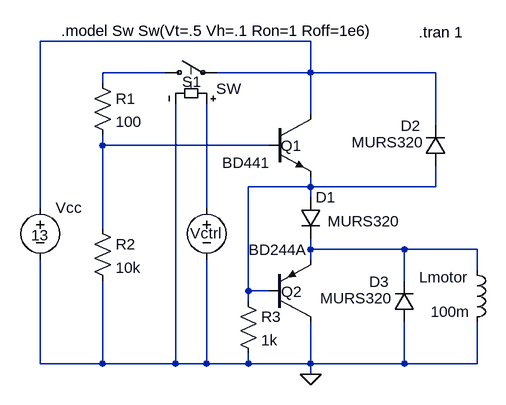
[diagram p0: schematic 2qSwMotorCc&Freno.asc]
2qSwMotorCc&Freno.asc, the LTspice schematic file:
Version 4
SHEET 1 880 680
WIRE 0 208 0 -48
WIRE 0 448 0 288
WIRE 96 16 96 0
WIRE 96 112 96 96
WIRE 96 240 96 112
WIRE 96 448 0 448
WIRE 96 448 96 320
WIRE 192 0 96 0
WIRE 208 448 96 448
WIRE 208 448 208 48
WIRE 256 208 256 48
WIRE 256 448 208 448
WIRE 256 448 256 288
WIRE 320 336 320 176
WIRE 320 352 320 336
WIRE 320 448 256 448
WIRE 320 448 320 432
WIRE 352 112 96 112
WIRE 352 336 320 336
WIRE 416 -48 0 -48
WIRE 416 0 272 0
WIRE 416 0 416 -48
WIRE 416 64 416 0
WIRE 416 176 320 176
WIRE 416 176 416 160
WIRE 416 192 416 176
WIRE 416 272 416 256
WIRE 416 288 416 272
WIRE 416 448 320 448
WIRE 416 448 416 384
WIRE 416 464 416 448
WIRE 560 272 416 272
WIRE 560 320 560 272
WIRE 560 448 416 448
WIRE 560 448 560 384
WIRE 608 0 416 0
WIRE 608 80 608 0
WIRE 608 176 416 176
WIRE 608 176 608 144
WIRE 672 272 560 272
WIRE 672 304 672 272
WIRE 672 448 560 448
WIRE 672 448 672 384
FLAG 416 464 0
SYMBOL pnp2 352 384 M180
WINDOW 0 19 47 Left 0
WINDOW 3 -31 111 Left 0
SYMATTR InstName Q2
SYMATTR Value BD244A
SYMBOL npn2 352 64 R0
WINDOW 0 18 49 Left 0
WINDOW 3 -72 75 Left 0
SYMATTR InstName Q1
SYMATTR Value BD441
SYMBOL diode 576 384 R180
WINDOW 0 39 62 Left 0
WINDOW 3 34 37 Left 0
SYMATTR InstName D3
SYMATTR Value MURS320
SYMBOL diode 400 192 R0
WINDOW 3 42 37 Left 0
SYMATTR InstName D1
SYMATTR Value MURS320
SYMBOL diode 624 144 R180
WINDOW 0 39 62 Left 0
WINDOW 3 34 37 Left 0
SYMATTR InstName D2
SYMATTR Value MURS320
SYMBOL res 304 336 R0
SYMATTR InstName R3
SYMATTR Value 1k
SYMBOL res 80 224 R0
SYMATTR InstName R2
SYMATTR Value 10k
SYMBOL sw 176 0 R270
WINDOW 0 -14 42 VRight 0
WINDOW 3 -25 95 VRight 0
SYMATTR InstName S1
SYMBOL res 80 0 R0
SYMATTR InstName R1
SYMATTR Value 100
SYMBOL voltage 0 192 R0
WINDOW 3 -14 58 Left 0
SYMATTR InstName Vcc
SYMATTR Value 13
SYMBOL ind 656 288 R0
WINDOW 0 -73 27 Left 0
WINDOW 3 -55 80 Left 0
SYMATTR InstName Lmotor
SYMATTR Value 100m
SYMATTR SpiceLine Rser=.1
SYMBOL voltage 256 192 R0
WINDOW 0 -25 55 Left 0
WINDOW 3 -14 58 Invisible 0
WINDOW 123 0 0 Left 0
WINDOW 39 0 0 Left 0
SYMATTR InstName Vctrl
SYMATTR Value PULSE(0 1 0 250m 250m 0 .5)
TEXT 32 -64 Left 0 !.model Sw Sw(Vt=.5 Vh=.1 Ron=1 Roff=1e6)
TEXT 582 -62 Left 0 !.tran 1

The netlist it stands for:
* 2qSwMotorCc&Freno.asc
Q2 0 N005 N006 0 BD244A
Q1 N001 N003 N005 0 BD441
D3 0 N006 MURS320
D1 N005 N006 MURS320
D2 N005 N001 MURS320
R3 N005 0 1k
R2 N003 0 10k
S1 N002 N001 N004 0 SW
R1 N002 N003 100
Vcc N001 0 13
Lmotor N006 0 100m Rser=.1
Vctrl N004 0 PULSE(0 1 0 250m 250m 0 .5)
.model D D
.lib standard.dio
.model NPN NPN
.model PNP PNP
.lib standard.bjt
.model Sw Sw(Vt=.5 Vh=.1 Ron=1 Roff=1e6)
.tran 1
.backanno
.end